# EasyEDA Pro project ProPrj_51单片机核心板_2025-03-03.epro

# Schematic 原理图
Board Name: 核心板; Create Date: 2025-02-26; Page Name: P1; Project Name: 51单片机核心板; Schematic Name: 原理图; Update Date: 2025-02-28; Company: 嘉立创EDA; Page Size: A4; Version: V1.0
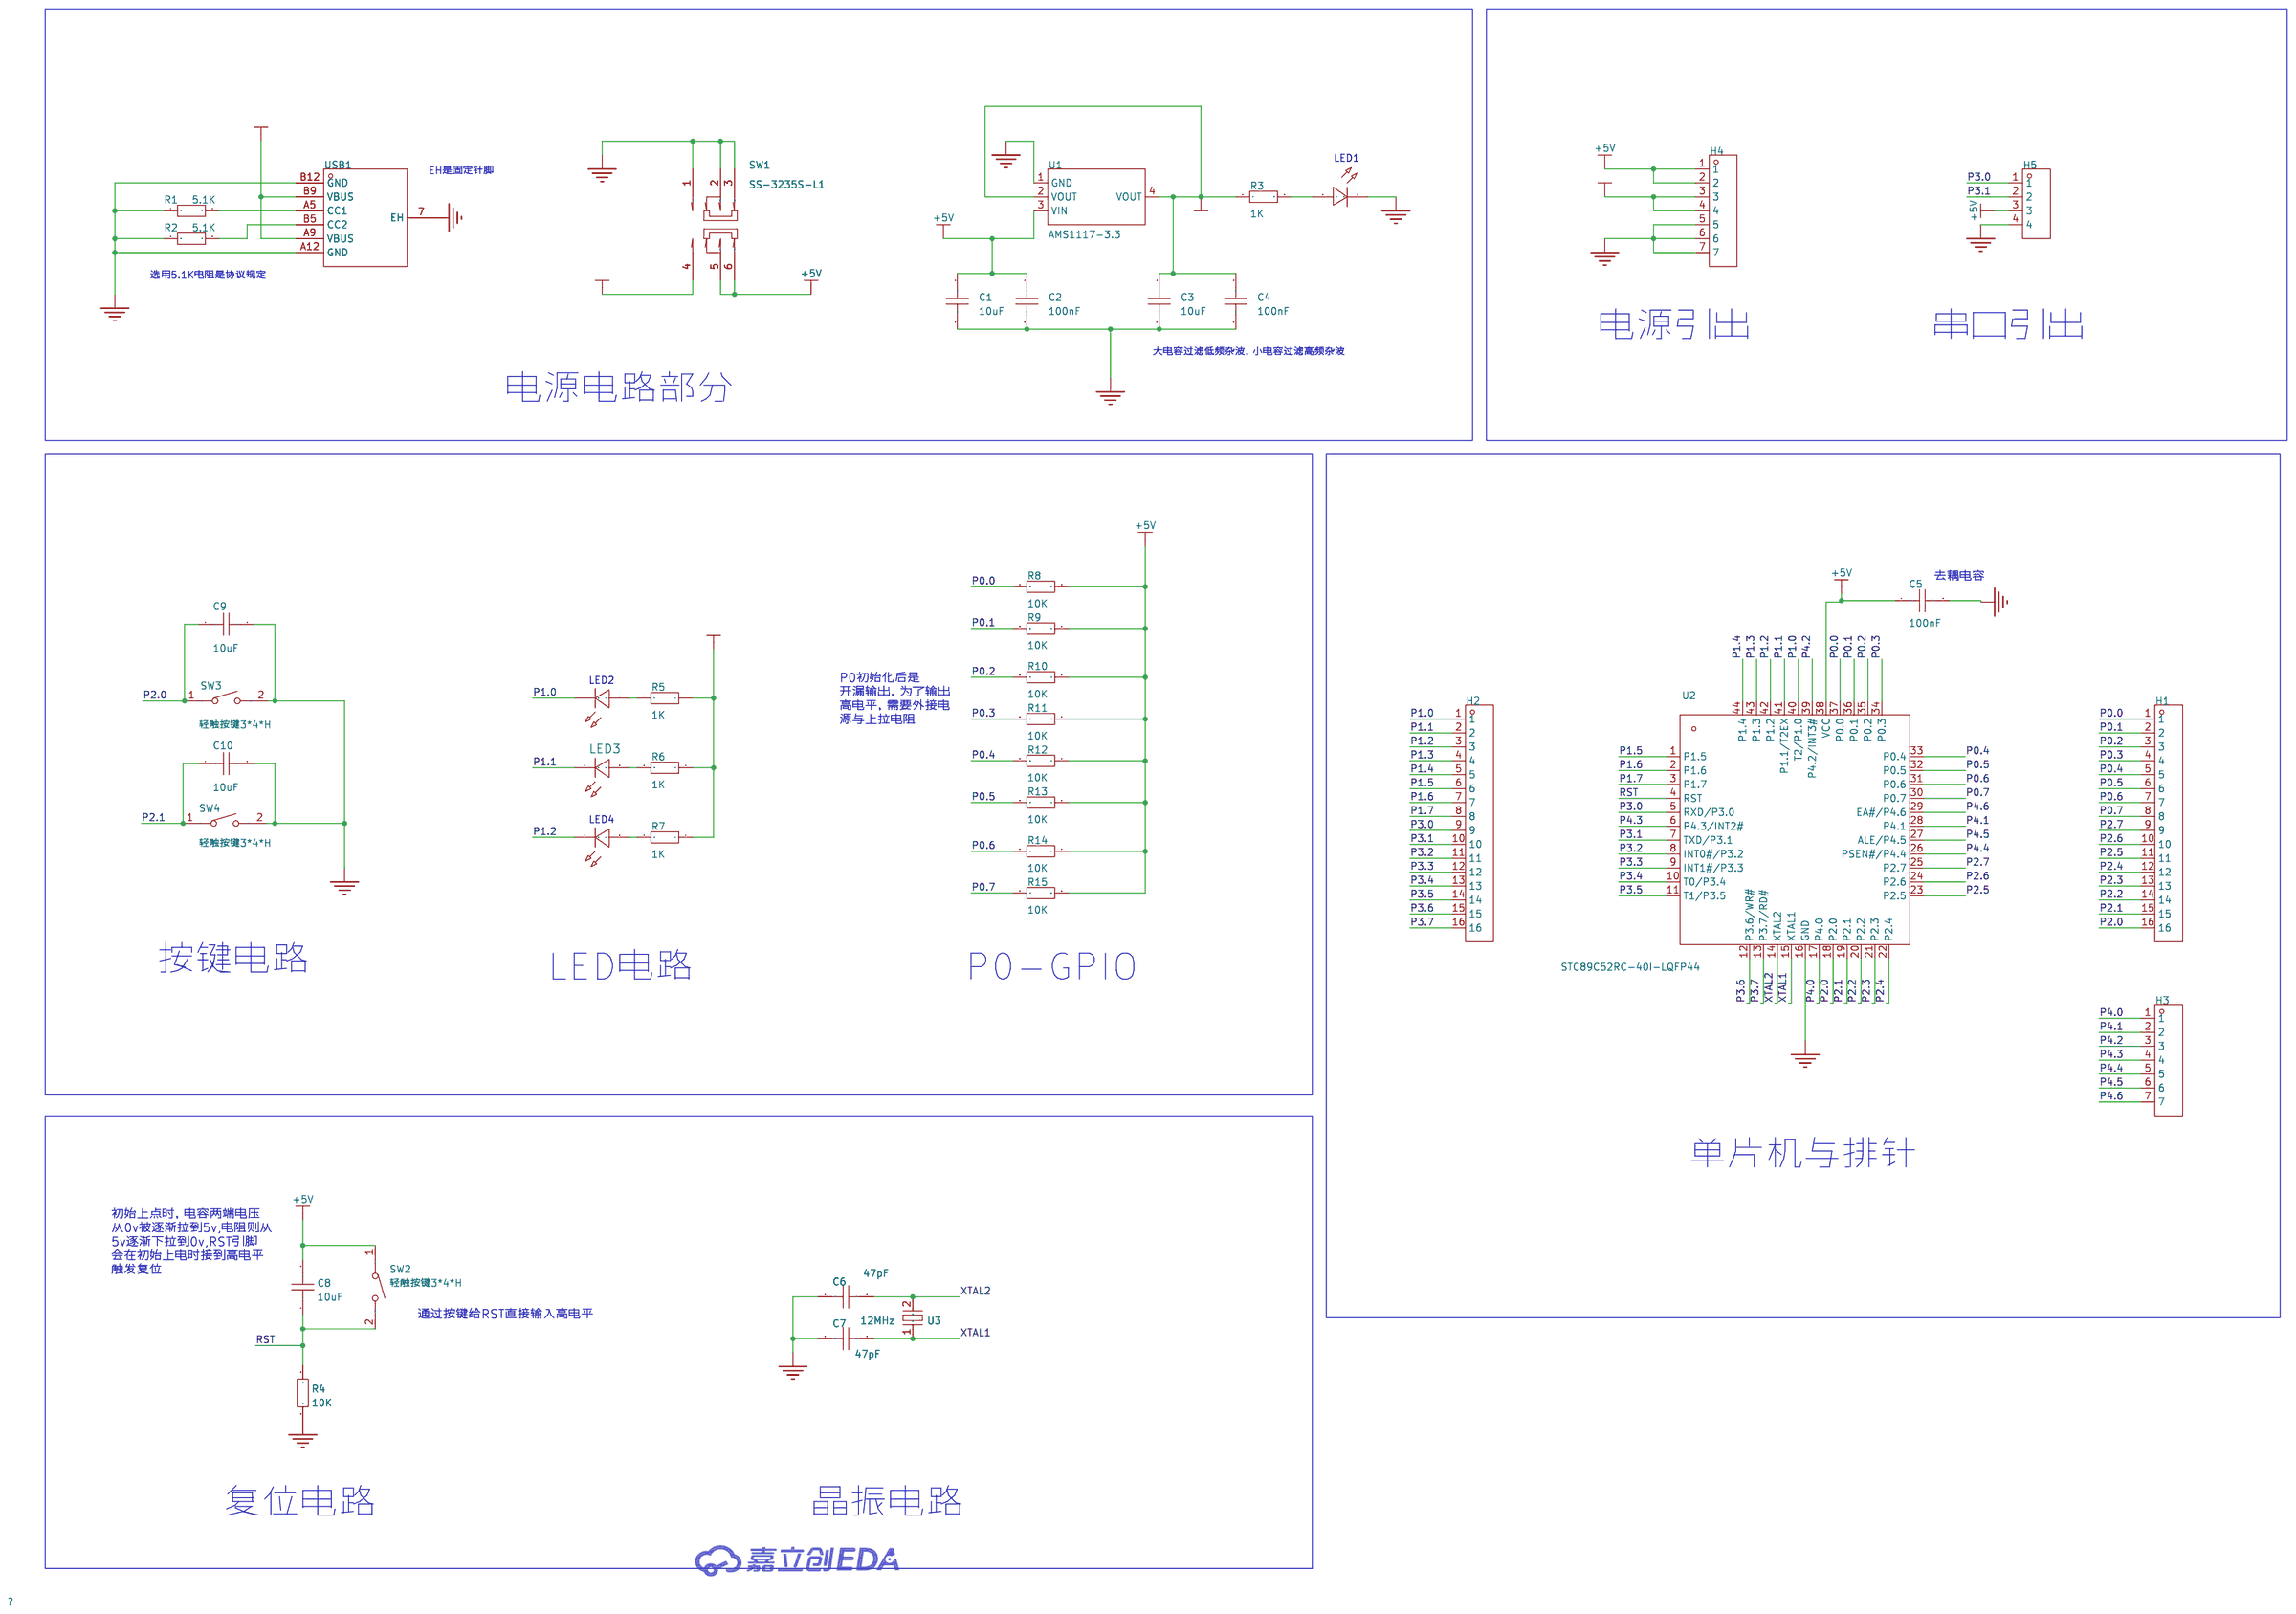
[diagram p0: schematic sheet]

## Parts
C1  10uF  [C0805]
C2  100nF  [C0805]
C3  10uF  [C0805]
C4  100nF  [C0805]
C5  100nF  [C0805]
C6  47pF  [C0805]
C7  47pF  [C0805]
C8  10uF  [C0805]
C9  10uF  [C0805]
C10  10uF  [C0805]
H1  -  [HDR-TH_16P-P2.54-V-M]
H2  -  [HDR-TH_16P-P2.54-V-M]
H3  -  [HDR-TH_7P-P2.54-V-M]
H4  -  [HDR-TH_7P-P2.54-V-M]
H5  -  [HDR-TH_4P-P2.54-V-M]
LED1  -  [LED_0805]
LED2  -  [LED_0805]
LED3  -  [LED_0805]
LED4  -  [LED_0805]
R1  5.1K  [R0805]
R2  5.1K  [R0805]
R3  1K  [R0805]
R4  10K  [R0805]
R5  1K  [R0805]
R6  1K  [R0805]
R7  1K  [R0805]
R8  10K  [R0805]
R9  10K  [R0805]
R10  10K  [R0805]
R11  10K  [R0805]
R12  10K  [R0805]
R13  10K  [R0805]
R14  10K  [R0805]
R15  10K  [R0805]
SW1  SS-3235S-L1  [SW-SMD_SS-3235S-LX]
SW2  轻触按键3*4*H  [SW-SMD_L4.0-W2.9-LS5.0]
SW3  轻触按键3*4*H  [SW-SMD_L4.0-W2.9-LS5.0]
SW4  轻触按键3*4*H  [SW-SMD_L4.0-W2.9-LS5.0]
U1  AMS1117-3.3  [SOT-223-3_L6.5-W3.4-P2.30-LS7.0-BR]
U2  STC89C52RC-40I-LQFP44  [LQFP-44_L10.0-W10.0-P0.80-LS12.0-BL]
U3  12MHz  [CRYSTAL-SMD_L11.4-W4.7-LS12.7]
USB1  TYPE-C-6P-DIP2X2  [TYPE-C-SMD_TYPE-C-6P]

## Library data of the parts
C1-C10 = CAP_0805: Supplier Footprint: 0805
H1 H2 = HDR-M_2.54_1x16P: 间距:2.54mm;总PIN位数:16;排数:1;插针结构:1x16P;行距:-;安装类型:直插;圆针/方针:方针;额定电流:3A;额定电压:-;配合针长度:6mm;塑高:2.5mm;端接针长度:3mm;触头材质:-;工作温度范围:-40℃~+105℃;颜色:黑色;; Supplier Part: C2894939; Supplier Footprint: 插件
H3 H4 = HDR-M_2.54_1x7P: Supplier Part: C492406; Supplier Footprint: 插件
H5 = HDR-M_2.54_1x4P: Supplier Part: C492403; Supplier Footprint: 插件
LED1 LED2 = LED_0805-G: Supplier Footprint: 0805
LED3 = LED_0805-R: Supplier Footprint: 0805
LED4 = LED_0805-B: Supplier Footprint: 0805
R1-R15 = Res_0805: Supplier Footprint: 0805
SW1 = SS-3235S-L1: 电路结构:双刀双掷;安装方式:卧贴;开关颜色:黑色;额定电流(DC):50mA;额定电压(DC):12V;额定电流(AC):50mA;额定电压(AC):12V;机械寿命:1万次;; LCSC Part Name: 柄长2mm 卧贴双档 滑动开关; Supplier Part: C500055; Manufacturer: XKB Connectivity(中国星坤); Supplier Footprint: SMD; JLCPCB Part Class: 扩展库; Datasheet: https://atta.szlcsc.com/upload/public/pdf/source/20211011/39D516E750C13BE9339464E723D9F132.pdf; Supplier: LCSC; Circuit: 双刀双掷; Actuator Style: 矩形柱状; Pin Style: 鸥翼型; Switch Length: 9.1mm; Switch Width: 3.55mm; Switch Height: 3.2mm; Mounting Style: 卧贴; Actuator Color: 黑色; Current Rating (DC): 50mA; Voltage Rating (DC): 12V; Current Rating (AC): 50mA; Voltage Rating (AC): 12V; Mechanical Life: 1万次; Operating Temperature: -40℃~+85℃
SW2-SW4 = 轻触按键3*4*H: Supplier Part: C9900017573; Supplier Footprint: 轻触按键3*4*2.5; JLCPCB Part Class: 扩展库; Supplier: LCSC
U1 = AMS1117-3.3_C6186: 输出类型:固定;工作电压:-;输出电压:3.3V;输出电流:1A;电源纹波抑制比(PSRR):72dB@(120Hz);输出极性:正极;; LCSC Part Name: 输出3.3V 1A; Supplier Part: C6186; Manufacturer: AMS; Supplier Footprint: SOT-223; JLCPCB Part Class: 基础库; Datasheet: https://atta.szlcsc.com/upload/public/pdf/source/20180727/C6186_7A095716F0823C02F1997A905E26C086.pdf; Supplier: LCSC; Output Type: 固定; Output Voltage: 3.3V; Output Current: 1A; Power Supply Rejection Ratio (PSRR): 72dB@(120Hz); Voltage Dropout: 1.3V@(800mA); Features: 过流保护(OCP)；热保护(TSD); Output Configuration: 正极; Number of Outputs: 1
U2 = STC89C52RC-40I-LQFP44: CPU内核:51系列;应用领域:-;; Supplier Part: C8707; Manufacturer: STC; Supplier Footprint: LQFP-44(10x10); JLCPCB Part Class: 扩展库; Datasheet: https://atta.szlcsc.com/upload/public/pdf/source/20241226/242305099CBBF4767F79975207B2F263.pdf; Supplier: LCSC; CPU Core: 51系列; Program Storage Size: 8KB; Program Memory Type: FLASH; Number of I/O: 39; Low Voltage Detection Threshold: 3.3V~5.5V
U3 = ABLS-12.000MHZ-B4H-T: 频率:12MHz;常温频差:±30ppm;外接负载电容:18pF;频率稳定度(全温):±35ppm;; LCSC Part Name: 12MHz ±30ppm 18pF; Supplier Part: C1986452; Manufacturer: ABRACON; Supplier Footprint: HC-49S-SMD; JLCPCB Part Class: 扩展库; Datasheet: https://atta.szlcsc.com/upload/public/pdf/source/20210612/96A8D0E14BE5C26ADD56CBF11909D043.pdf; Supplier: LCSC; Normal temperature Frequency Tolerance: ±30ppm; External load capacitor: 18pF; Frequency Stability(Full temperature range): ±35ppm; Equivalent Series Resistance (ESR): 50Ω; Operating Temperature: -20℃~+70℃
USB1 = TYPE-C-6P-DIP2X2: Supplier Part: C9900017627; Supplier Footprint: TYPE-C-6P; JLCPCB Part Class: 扩展库; Supplier: LCSC

## Nets
+3.3V: C3.1 C4.1 H4.3 H4.4 R3.1 R5.1 R6.1 R7.1 U1.2(VOUT) U1.4(VOUT)
+5V: C1.1 C2.1 C5.1 C8.2 H4.1 H4.2 H5.3 R8.1 R9.1 R10.1 R11.1 R12.1 R13.1 R14.1 R15.1 SW1.5 SW1.6 SW2.1 U1.3(VIN) U2.38(VCC)
GND: C1.2 C2.2 C3.2 C4.2 C5.2 C6.1 C7.1 C9.2 C10.2 H4.5 H4.6 H4.7 H5.4 LED1.1(C) R1.1 R2.1 R4.1 SW1.1 SW1.2 SW1.3 SW3.2 SW4.2 U1.1(GND) U2.16(GND) USB1.7(EH) USB1.A12(GND) USB1.B12(GND)
VCC+5V: SW1.4 USB1.A9(VBUS) USB1.B9(VBUS)
P0.0: H1.1 R8.2 U2.37(P0.0)
P0.1: H1.2 R9.2 U2.36(P0.1)
P0.2: H1.3 R10.2 U2.35(P0.2)
P0.3: H1.4 R11.2 U2.34(P0.3)
P0.4: H1.5 R12.2 U2.33(P0.4)
P0.5: H1.6 R13.2 U2.32(P0.5)
P0.6: H1.7 R14.2 U2.31(P0.6)
P0.7: H1.8 R15.2 U2.30(P0.7)
P1.0: H2.1 LED2.1(C) U2.40(T2/P1.0)
P1.1: H2.2 LED3.1(C) U2.41(P1.1/T2EX)
P1.2: H2.3 LED4.1(C) U2.42(P1.2)
P1.3: H2.4 U2.43(P1.3)
P1.4: H2.5 U2.44(P1.4)
P1.5: H2.6 U2.1(P1.5)
P1.6: H2.7 U2.2(P1.6)
P1.7: H2.8 U2.3(P1.7)
P2.0: C9.1 H1.16 SW3.1 U2.18(P2.0)
P2.1: C10.1 H1.15 SW4.1 U2.19(P2.1)
P2.2: H1.14 U2.20(P2.2)
P2.3: H1.13 U2.21(P2.3)
P2.4: H1.12 U2.22(P2.4)
P2.5: H1.11 U2.23(P2.5)
P2.6: H1.10 U2.24(P2.6)
P2.7: H1.9 U2.25(P2.7)
P3.0: H2.9 H5.1 U2.5(RXD/P3.0)
P3.1: H2.10 H5.2 U2.7(TXD/P3.1)
P3.2: H2.11 U2.8(INT0#/P3.2)
P3.3: H2.12 U2.9(INT1#/P3.3)
P3.4: H2.13 U2.10(T0/P3.4)
P3.5: H2.14 U2.11(T1/P3.5)
P3.6: H2.15 U2.12(P3.6/WR#)
P3.7: H2.16 U2.13(P3.7/RD#)
P4.0: H3.1 U2.17(P4.0)
P4.1: H3.2 U2.28(P4.1)
P4.2: H3.3 U2.39(P4.2/INT3#)
P4.3: H3.4 U2.6(P4.3/INT2#)
P4.4: H3.5 U2.26(PSEN#/P4.4)
P4.5: H3.6 U2.27(ALE/P4.5)
P4.6: H3.7 U2.29(EA#/P4.6)
RST: C8.1 R4.2 SW2.2 U2.4(RST)
XTAL1: C7.2 U2.15(XTAL1) U3.1
XTAL2: C6.2 U2.14(XTAL2) U3.2(GND)
$1N241: R1.2 USB1.A5(CC1)
$1N246: R2.2 USB1.B5(CC2)
$1N1025: LED1.2(A) R3.2
$1N3844: LED2.2(A) R5.2
$1N3871: LED3.2(A) R6.2
$1N3939: LED4.2(A) R7.2

## Notes on the sheet
- EH是固定针脚
- 选用5.1K电阻是协议规定
- 电源引出
- 串口引出
- 大电容过滤低频杂波，小电容过滤高频杂波
- 电源电路部分
- 去耦电容
- P0初始化后是
  开漏输出，为了输出
  高电平，需要外接电
  源与上拉电阻
- 按键电路
- LED电路
- P0-GPIO
- 单片机与排针
- 初始上点时，电容两端电压
  从0v被逐渐拉到5v,电阻则从
  5v逐渐下拉到0v,RST引脚
  会在初始上电时接到高电平
  触发复位
- 通过按键给RST直接输入高电平
- 复位电路
- 晶振电路

# Board PCB
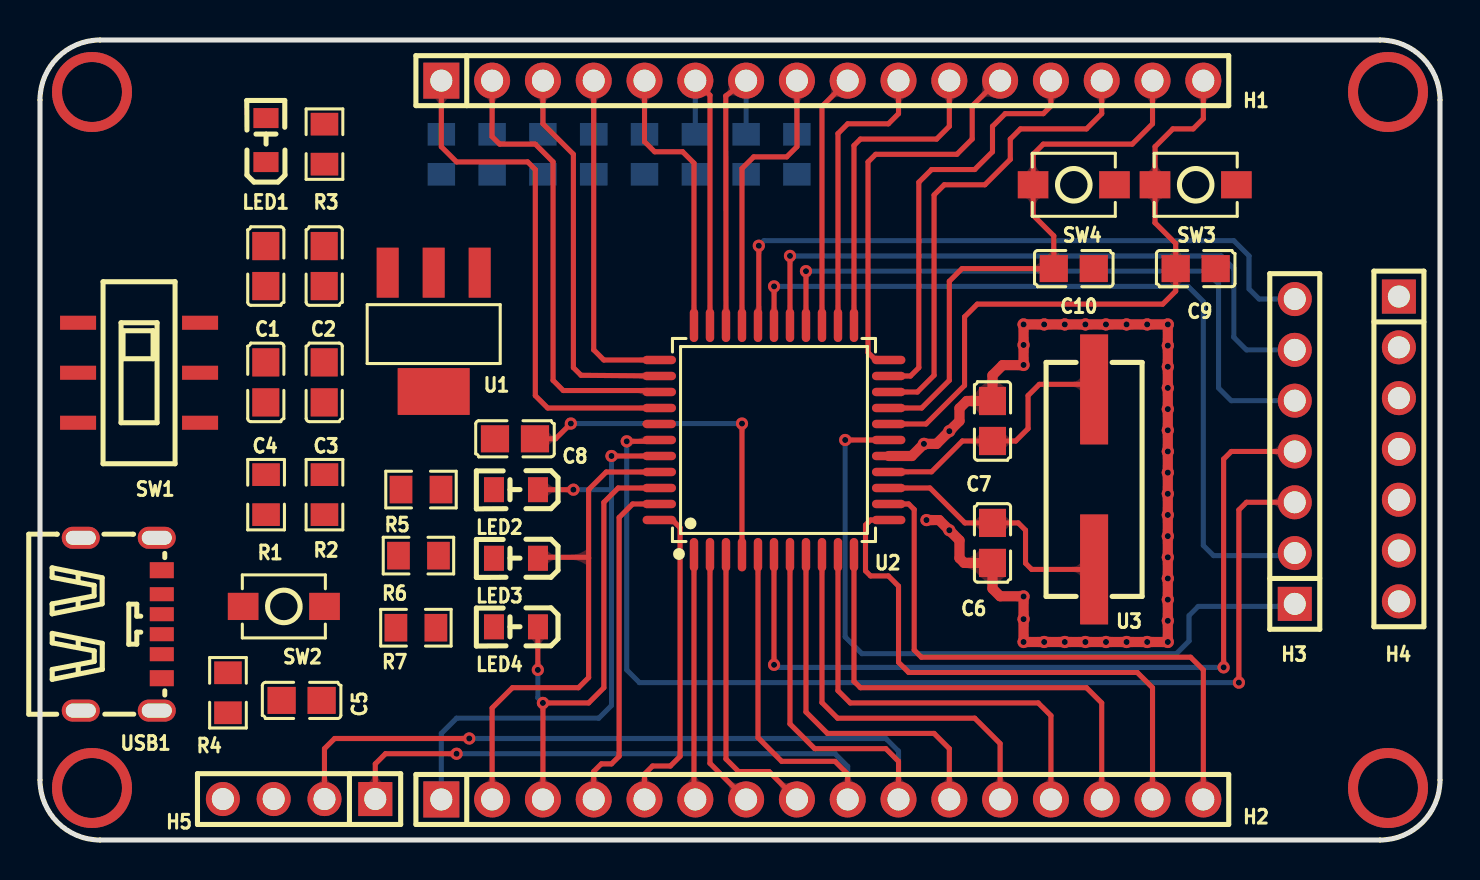
[diagram p1: board, top side]
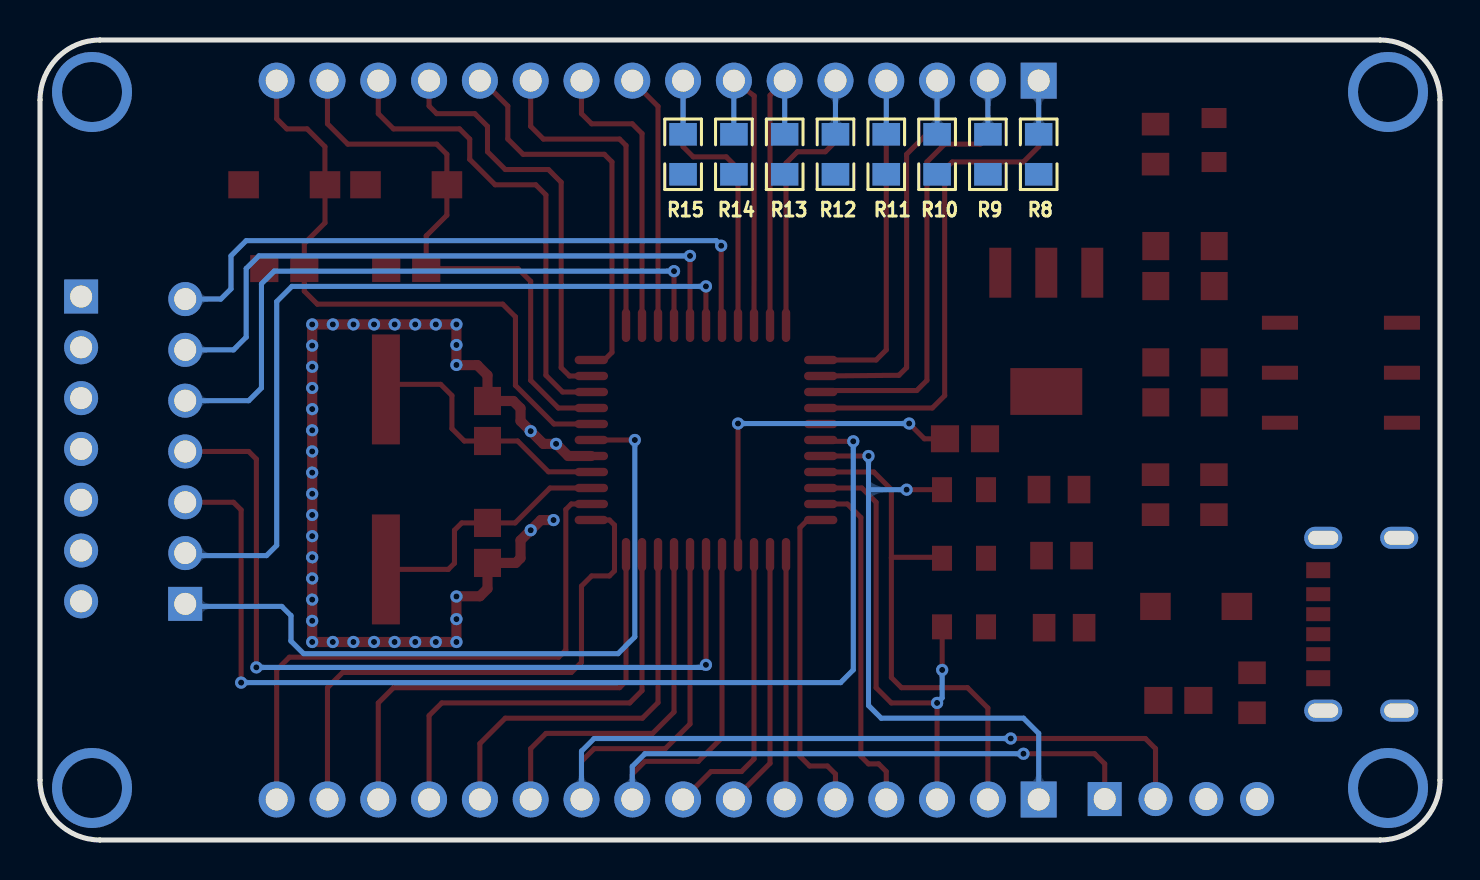
[diagram p2: board, bottom side, seen from below]

Outline 70 x 40 mm; copper layers: Top Layer, Bottom Layer. Coordinates in mm from the lower left corner of the outline.
Outline path: 0,37 0,3 arc(0.88,0.88) 3,0 67,0 arc(69.12,0.88) 70,3 70,37 arc(69.12,39.12) 67,40 3,40 arc(0.88,39.12) 0,37
Stack: Top Layer 0.035mm / Dielectric1 1.51mm FR4 er 4.5 / Bottom Layer 0.035mm

## Design rules (mm)
net XTAL2: DP1
net XTAL1: DP1
template: JLCPCB Capability(Two Layers Board)
spacing copperThickness1oz (default): track to track 0.102, other pairs 0.152 to 0.3
spacing copperThickness2oz: track to track 0.203, other pairs 0.152 to 0.3
track width copperThickness1oz (default): min 0.127, default 0.254, max 2.54
track width copperThickness2oz: min 0.203, default 0.254, max 2.54
differential pair differentialPair (default): width min 0.127, default 0.254, max 2.54; gap min 0.152, default 0.152
via viaSize (default): diameter min 0.5, default 0.61, max 10; hole min 0.3, default 0.305, max 6.3

## Placement (name value [footprint] x y rotation side)
C1  10uF  [C0805]  11.29 28.7 270 top
C2  100nF  [C0805]  14.21 28.7 270 top
C3  10uF  [C0805]  14.21 22.88 270 top
C4  100nF  [C0805]  11.29 22.88 270 top
C5  100nF  [C0805]  13.08 6.98 0 top
C6  47pF  [C0805]  47.62 14.85 90 top
C7  47pF  [C0805]  47.62 20.95 270 top
C8  10uF  [C0805]  23.75 20.06 180 top
C9  10uF  [C0805]  57.78 28.57 0 top
C10  10uF  [C0805]  51.69 28.57 0 top
H1  -  [HDR-TH_16P-P2.54-V-M]  39.12 37.97 0 top
H2  -  [HDR-TH_16P-P2.54-V-M]  39.12 2.03 0 top
H3  -  [HDR-TH_7P-P2.54-V-M]  62.74 19.43 90 top
H4  -  [HDR-TH_7P-P2.54-V-M]  67.94 19.55 270 top
H5  -  [HDR-TH_4P-P2.54-V-M]  12.95 2.05 180 top
LED1  -  [LED_0805]  11.3 35.05 90 top
LED2  -  [LED_0805]  23.75 17.52 180 top
LED3  -  [LED_0805]  23.75 14.09 180 top
LED4  -  [LED_0805]  23.75 10.66 180 top
R1  5.1K  [R0805]  11.3 17.27 270 top
R2  5.1K  [R0805]  14.22 17.27 270 top
R3  1K  [R0805]  14.22 34.79 90 top
R4  10K  [R0805]  9.4 7.36 90 top
R5  1K  [R0805]  19.05 17.52 0 top
R6  1K  [R0805]  18.92 14.22 0 top
R7  1K  [R0805]  18.8 10.61 0 top
R8  10K  [R0805]  20.07 34.28 90 bottom
R9  10K  [R0805]  22.61 34.28 90 bottom
R10  10K  [R0805]  25.15 34.28 90 bottom
R11  10K  [R0805]  27.69 34.28 90 bottom
R12  10K  [R0805]  30.23 34.28 90 bottom
R13  10K  [R0805]  32.77 34.28 90 bottom
R14  10K  [R0805]  35.31 34.28 90 bottom
R15  10K  [R0805]  37.85 34.28 90 bottom
SW1  SS-3235S-L1  [SW-SMD_SS-3235S-LX]  4.95 23.36 90 top
SW2  轻触按键3*4*H  [SW-SMD_L4.0-W2.9-LS5.0]  12.19 11.68 0 top
SW3  轻触按键3*4*H  [SW-SMD_L4.0-W2.9-LS5.0]  57.78 32.76 0 top
SW4  轻触按键3*4*H  [SW-SMD_L4.0-W2.9-LS5.0]  51.69 32.76 0 top
U1  AMS1117-3.3  [SOT-223-3_L6.5-W3.4-P2.30-LS7.0-BR]  19.69 25.39 90 top
U2  STC89C52RC-40I-LQFP44  [LQFP-44_L10.0-W10.0-P0.80-LS12.0-BL]  36.7 20 0 top
U3  12MHz  [CRYSTAL-SMD_L11.4-W4.7-LS12.7]  52.71 18.03 270 top
USB1  TYPE-C-6P-DIP2X2  [TYPE-C-SMD_TYPE-C-6P]  4.06 10.79 270 top

## Footprints (pads in the part's own frame, mm; a bottom-side part is the same pattern mirrored in y, then rotated)
C0805
  rect 1.41x1.35 smd: 1(-1,0) 2(1,0)
CRYSTAL-SMD_L11.4-W4.7-LS12.7
  rect 5.5x1.4 smd: 1(-4.5,0) 2(4.5,0)
HDR-TH_4P-P2.54-V-M
  rect 1.7x1.7 hole 1.1: 1(-3.81,0)
  round 1.7 hole 1.1: 2(-1.27,0) 3(1.27,0) 4(3.81,0)
HDR-TH_7P-P2.54-V-M
  rect 1.7x1.7 hole 1.1: 1(-7.62,0)
  round 1.7 hole 1.1: 2(-5.08,0) 3(-2.54,0) 4(0,0) 5(2.54,0) 6(5.08,0) 7(7.62,0)
HDR-TH_16P-P2.54-V-M
  rect 1.8x1.8 hole 1.1: 1(-19.05,0)
  round 1.8 hole 1.1: 2(-16.51,0) 3(-13.97,0) 4(-11.43,0) 5(-8.89,0) 6(-6.35,0) 7(-3.81,0) 8(-1.27,0) 9(1.27,0) 10(3.81,0) 11(6.35,0) 12(8.89,0) 13(11.43,0) 14(13.97,0) 15(16.51,0) 16(19.05,0)
LED_0805
  rect 1x1.25 smd: 1(-1.15,0.005) 2(1.05,0.005)
LQFP-44_L10.0-W10.0-P0.80-LS12.0-BL
  oval 0.42x1.67 smd: 1(-4,-5.735) 2(-3.2,-5.735) 3(-2.4,-5.735) 4(-1.6,-5.735) 5(-0.8,-5.735) 6(0,-5.735) 7(0.8,-5.735) 8(1.6,-5.735) 9(2.4,-5.735) 10(3.2,-5.735) 11(4,-5.735) 23(4,5.735) 24(3.2,5.735) 25(2.4,5.735) 26(1.6,5.735) 27(0.8,5.735) 28(0,5.735) 29(-0.8,5.735) 30(-1.6,5.735) 31(-2.4,5.735) 32(-3.2,5.735) 33(-4,5.735)
  oval 1.67x0.42 smd: 12(5.735,-4) 13(5.735,-3.2) 14(5.735,-2.4) 15(5.735,-1.6) 16(5.735,-0.8) 17(5.735,0) 18(5.735,0.8) 19(5.735,1.6) 20(5.735,2.4) 21(5.735,3.2) 22(5.735,4) 34(-5.735,4) 35(-5.735,3.2) 36(-5.735,2.4) 37(-5.735,1.6) 38(-5.735,0.8) 39(-5.735,0) 40(-5.735,-0.8) 41(-5.735,-1.6) 42(-5.735,-2.4) 43(-5.735,-3.2) 44(-5.735,-4)
R0805
  rect 1.133x1.377 smd: 1(-1,0) 2(1,0)
SOT-223-3_L6.5-W3.4-P2.30-LS7.0-BR
  rect 2.5x1.1 smd: 1(2.97,-2.3) 2(2.97,0) 3(2.97,2.3)
  rect 2.34x3.6 smd: 4(-2.97,0)
SW-SMD_L4.0-W2.9-LS5.0
  rect 1.53x1.36 smd: 1(-2.035,0) 2(2.035,0)
SW-SMD_SS-3235S-LX
  rect 0.7x1.8 smd: 1(-2.5,3.05) 2(0,3.05) 3(2.5,3.05) 4(-2.5,-3.05) 5(0,-3.05) 6(2.5,-3.05)
TYPE-C-SMD_TYPE-C-6P
  oval 1.1x1.9 hole 0.7x1.5: 7(-4.32,1.775) 7(-4.32,-2.025) 7(4.32,1.775) 7(4.32,-2.025)
  rect 0.7x1.2 smd: A5(-0.5,2.025) A9(1.5,2.025) B5(0.5,2.025) B9(-1.5,2.025)
  rect 0.8x1.2 smd: A12(2.7,2.025) B12(-2.7,2.025)

## Nets
As in the schematic.

## Via types
v1: diameter 4, hole 3, Top Layer to Bottom Layer, 4 vias
v2: diameter 0.61, hole 0.305, Top Layer to Bottom Layer, 55 vias

## Routing (per net, layer and track width the routed paths; a pad name or vN(x,y) marks a point on that pad's centre or on a via; arc(x,y) is an arc through that point)
GND: length 52.1
  Top Layer w0.508: v2(56.39,25.78) v2(56.39,24.72) v2(56.39,23.66) v2(56.39,22.6) v2(56.39,21.54) v2(56.39,20.49) v2(56.39,19.43) v2(56.39,18.37) v2(56.39,17.31) v2(56.39,16.25) v2(56.39,15.19) v2(56.39,14.14) v2(56.39,13.08) v2(56.39,12.02) v2(56.39,10.96) v2(56.39,9.9) v2(55.36,9.9) v2(54.33,9.9) v2(53.3,9.9) v2(52.27,9.9) v2(51.24,9.9) v2(50.21,9.9) v2(49.18,9.9) v2(49.18,11.04) v2(49.18,12.18) 49.17,12.19 48.01,12.19 47.62,12.57 C6.1 46.21,13.85 45.97,14.09 45.97,14.98 v2(45.47,15.49) 44.96,16 v2(44.32,16) ; 56.39,25.78 v2(55.36,25.78) v2(54.33,25.78) v2(53.3,25.78) v2(52.27,25.78) v2(51.24,25.78) v2(50.21,25.78) v2(49.18,25.78) v2(49.18,24.75) v2(49.18,23.75) 49.17,23.74 48.13,23.74 47.62,23.24 C7.1 46.34,21.95 45.97,21.58 45.97,20.95 v2(45.47,20.44) 44.83,19.81 v2(44.2,19.81) 43.59,19.2 U2.16
(no net):
  vias: v1(2.6,37.4) v1(2.6,2.6) v1(67.4,37.4) v1(67.4,2.6)
P0.0: length 28.9
  Top Layer w0.254: H1.1 20.07,34.67 20.83,33.9 24.38,33.9 24.76,33.52 24.76,22.22 25.38,21.6 U2.37
  Bottom Layer w0.254: H1.1 R8.2
P0.1: length 25.5
  Top Layer w0.254: U2.36 30.89,22.47 26.16,22.47 25.65,22.98 25.65,33.9 24.76,34.79 22.99,34.79 22.61,35.17 H1.2
  Bottom Layer w0.254: H1.2 R9.2
P0.2: length 22.1
  Top Layer w0.254: U2.35 27.05,23.24 26.67,23.62 26.67,34.28 25.15,35.81 H1.3
  Bottom Layer w0.254: H1.3 R10.2
P0.3: length 19.6
  Top Layer w0.254: U2.34 28.19,24 27.69,24.51 H1.4
  Bottom Layer w0.254: H1.4 R11.2
P0.4: length 16.8
  Top Layer w0.254: H1.5 30.23,34.92 30.73,34.41 32.13,34.41 32.7,33.84 U2.33
  Bottom Layer w0.254: H1.5 R12.2
P0.5: length 15.2
  Top Layer w0.254: U2.32 33.5,37.23 H1.6
  Bottom Layer w0.254: H1.6 R13.2
P0.6: length 15.4
  Top Layer w0.254: H1.7 34.29,37.21 U2.31
  Bottom Layer w0.254: H1.7 R14.2
P0.7: length 17
  Top Layer w0.254: U2.30 35.1,33.57 35.69,34.16 37.34,34.16 37.85,34.67 H1.8
  Bottom Layer w0.254: H1.8 R15.2
P1.0: length 30.9
  Top Layer w0.254: U2.40 v2(28.57,19.2) ; LED2.1 v2(26.67,17.52)
  Bottom Layer w0.254: 28.57,17.53 28.57,6.73 27.94,6.09 20.83,6.09 20.07,5.33 H2.1 ; 28.57,17.53 28.56,17.52 v2(26.67,17.52) ; 28.57,17.53 v2(28.57,19.2)
P1.1: length 26
  Top Layer w0.254: 27.43,14.11 27.4,14.14 24.77,14.14 ; 27.43,14.11 27.43,8.12 26.92,7.61 23.62,7.61 22.61,6.6 H2.2 ; 27.43,14.11 27.43,17.52 28.31,18.4 U2.41
P1.2: length 24.4
  Top Layer w0.254: U2.42 28.91,17.6 28.19,16.89 28.19,7.61 27.43,6.85 v2(25.15,6.85) H2.3 ; v2(24.89,8.5) 24.89,10.65 LED4.1
  Bottom Layer w0.254: v2(25.15,6.85) 24.89,7.11 v2(24.89,8.5)
P1.3: length 17.2
  Top Layer w0.254: H2.4 27.69,3.42 28.07,3.81 28.57,3.81 28.96,4.19 28.96,16.12 29.63,16.8 U2.43
P1.4: length 16
  Top Layer w0.254: U2.44 31.62,16 32,15.62 32,4.19 31.52,3.7 30.63,3.7 30.23,3.3 H2.5
P1.5: length 12.3
  Top Layer w0.254: H2.6 32.7,2.09 U2.1
P1.6: length 13
  Top Layer w0.254: U2.2 33.5,3.83 H2.7
P1.7: length 14.6
  Top Layer w0.254: H2.8 36.45,3.42 34.93,3.42 34.3,4.05 U2.3
P2.0: length 31.7
  Top Layer w0.254: U2.18 44.3,20.8 46.23,22.73 46.23,26.16 46.86,26.79 56.13,26.79 56.78,27.44 C9.1 56.78,29.82 55.75,30.86 SW3.1 55.75,32.76 55.75,34.67 56.64,35.56 57.66,35.56 58.17,36.06 H1.16
P2.1: length 28.9
  Top Layer w0.254: H1.15 55.63,35.81 54.61,34.79 50.16,34.79 49.66,34.28 49.66,32.76 SW4.1 49.66,32.76 49.66,31.24 50.69,30.2 C10.1 46.1,28.57 45.47,27.94 45.47,22.98 44.08,21.6 U2.19
P2.2: length 23.9
  Top Layer w0.254: U2.20 43.87,22.4 44.7,23.24 44.7,32.25 45.21,32.76 47.24,32.76 48.51,34.03 48.51,35.05 49.02,35.56 52.32,35.56 53.09,36.32 H1.14
P2.3: length 21.1
  Top Layer w0.254: H1.13 50.55,36.7 50.16,36.32 48.26,36.32 47.62,35.68 47.62,34.41 46.74,33.52 44.58,33.52 43.94,32.89 43.94,23.62 43.53,23.2 U2.21
P2.4: length 20
  Top Layer w0.254: H1.12 47.88,37.97 46.61,36.7 46.61,35.05 45.85,34.28 41.78,34.28 41.4,33.9 41.4,24.38 41.78,24 U2.22
P2.5: length 16.4
  Top Layer w0.254: H1.11 45.47,35.68 44.83,35.05 41.02,35.05 40.7,34.72 U2.23
P2.6: length 14.7
  Top Layer w0.254: H1.10 42.93,36.32 42.42,35.81 40.39,35.81 39.9,35.32 U2.24
P2.7: length 12.8
  Top Layer w0.254: U2.25 39.1,36.68 H1.9
P3.0: length 43.2
  Top Layer w0.254: H2.9 40.39,3.3 39.75,3.93 37.08,3.93 35.9,5.12 U2.5 ; v2(20.83,4.31) 17.27,4.31 16.76,3.81 H5.1
  Bottom Layer w0.254: v2(20.83,4.31) 39.75,4.31 40.39,3.68 H2.9
P3.1: length 50.7
  Top Layer w0.254: U2.7 37.5,5.8 38.74,4.57 42.29,4.57 42.93,3.93 H2.10 ; H5.2 14.22,4.57 14.73,5.08 v2(21.46,5.08)
  Bottom Layer w0.254: H2.10 42.93,4.44 42.29,5.08 v2(21.46,5.08)
P3.2: length 18.3
  Top Layer w0.254: H2.11 45.47,4.57 44.7,5.33 39.37,5.33 38.3,6.4 U2.8
P3.3: length 19.9
  Top Layer w0.254: H2.12 48.01,4.82 46.74,6.09 39.88,6.09 39.1,6.87 U2.9
P3.4: length 22.2
  Top Layer w0.254: U2.10 39.9,7.47 40.51,6.85 49.91,6.85 50.55,6.22 H2.13
P3.5: length 24
  Top Layer w0.254: U2.11 40.7,7.94 41.02,7.61 52.32,7.61 53.09,6.85 H2.14
P3.6: length 28.1
  Top Layer w0.254: H2.15 55.63,7.61 54.86,8.38 43.43,8.38 42.93,8.89 42.93,12.69 42.42,13.2 41.53,13.2 41.28,13.46 41.28,15.75 41.53,16 U2.12
P3.7: length 29.8
  Top Layer w0.254: U2.13 43.43,16.8 43.71,16.53 43.71,9.5 44.07,9.14 57.53,9.14 58.17,8.5 H2.16
P4.0: length 36.6
  Top Layer w0.254: U2.17 v2(40.26,20)
  Bottom Layer w0.254: H3.1 62.61,11.68 57.91,11.68 57.45,11.22 57.45,9.95 56.82,9.32 41.1,9.32 40.26,10.16 v2(40.26,20)
P4.1: length 40.8
  Top Layer w0.254: v2(36.7,27.68) 36.7,25.74 U2.28
  Bottom Layer w0.254: v2(36.7,27.68) 57.4,27.68 58.17,26.92 58.17,14.73 58.67,14.22 62.61,14.22 H3.2
P4.2: length 55.5
  Top Layer w0.254: H3.3 60.32,16.89 59.94,16.5 v2(59.94,7.87) ; U2.39 30.9,19.93 v2(29.34,19.93)
  Bottom Layer w0.254: v2(59.94,7.87) 29.97,7.87 29.34,8.5 v2(29.34,19.93)
P4.3: length 42.2
  Top Layer w0.254: v2(59.18,8.63) 59.18,19.05 59.56,19.43 H3.4 ; U2.6 36.7,8.76 v2(36.7,8.76)
  Bottom Layer w0.254: v2(59.18,8.63) 59.18,8.63 36.83,8.63 v2(36.7,8.76)
P4.4: length 32.9
  Top Layer w0.254: U2.26 v2(38.3,28.44)
  Bottom Layer w0.254: v2(38.3,28.44) 58.29,28.44 58.93,27.81 58.93,22.6 59.56,21.97 H3.5
P4.5: length 32.7
  Top Layer w0.254: U2.27 v2(37.5,29.2)
  Bottom Layer w0.254: v2(37.5,29.2) 59.06,29.2 59.69,28.57 59.69,25.14 60.32,24.51 H3.6
P4.6: length 33.1
  Top Layer w0.254: v2(35.94,29.71) 35.94,25.78 U2.29
  Bottom Layer w0.254: v2(35.94,29.71) 36.19,29.97 59.69,29.97 60.45,29.2 60.45,27.55 60.96,27.05 H3.7
RST: length 17.2
  Top Layer w0.254: v2(26.54,20.82) 25.78,20.06 C8.1 ; U2.4 v2(35.1,20.82)
  Bottom Layer w0.254: v2(35.1,20.82) v2(26.54,20.82)
XTAL1: length 13.1
  Top Layer w0.254: 52.71,22.78 49.97,22.78 49.4,22.22 49.4,20.57 48.78,19.95 C7.2 46.12,19.95 44.58,18.41 42.44,18.41 U2.15
XTAL2: length 12.9
  Top Layer w0.254: U2.14 44.5,17.6 46.24,15.85 C6.2 48.91,15.85 49.28,15.49 49.28,13.84 49.59,13.53 U3.2

Small or netless copper shapes (teardrops, artwork), in the pictures only: 192 on Top Layer, 34 on Bottom Layer
